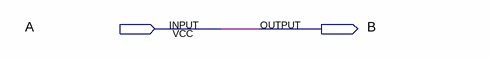
[diagram p0: schematic sheet]
// Quartus schematic line.bdf as structural Verilog: 0 symbols, 2 pins
module line (
  input  A,
  output B
);


  assign B = A;
endmodule
